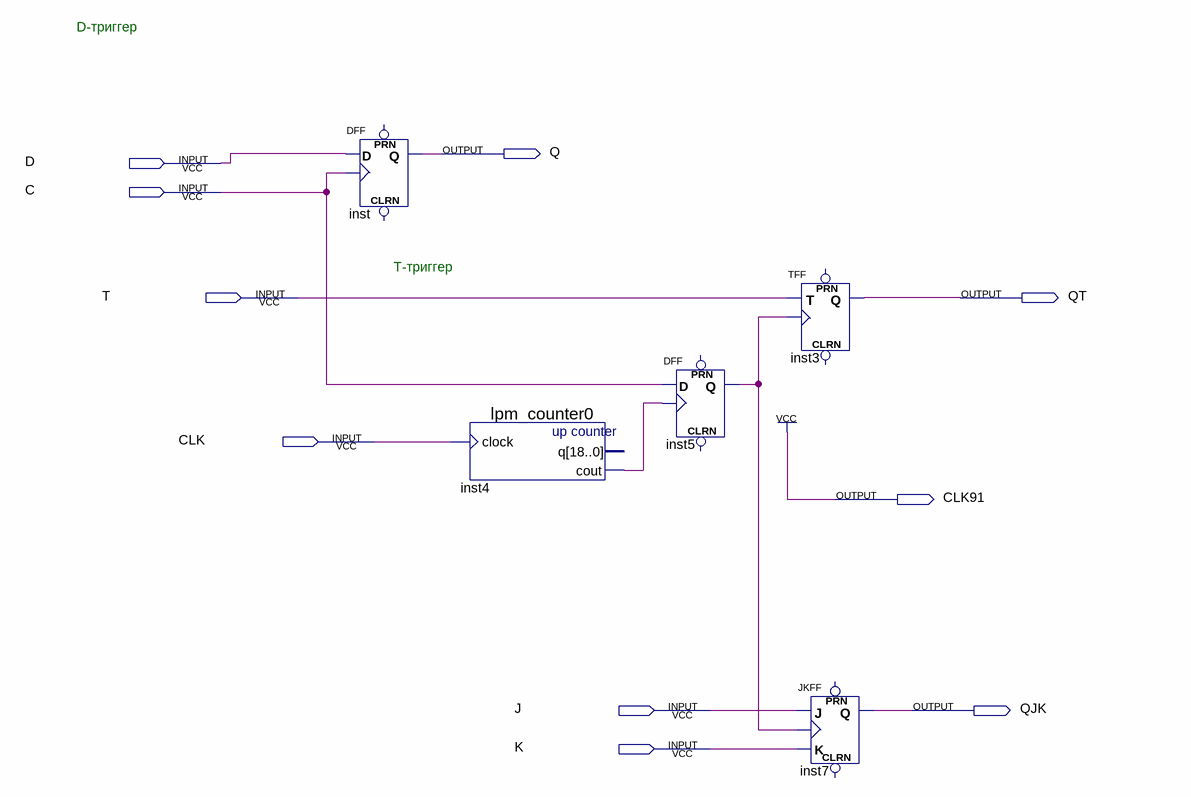
[diagram p0: schematic sheet]
// Quartus schematic D_T_LK-triggers.bdf as structural Verilog: 5 symbols, 10 pins
module \D_T_LK-triggers  (
  input  D,
  input  C,
  input  T,
  input  CLK,
  input  J,
  input  K,
  output Q,
  output QT,
  output CLK91,
  output QJK
);

  wire inst4_cout, inst5_q;

  DFF inst (.CLK(C), .D(D), .Q(Q));  // open: CLRN, PRN
  lpm_counter0 inst4 (.clock(CLK), .cout(inst4_cout));  // open: q
  DFF inst5 (.CLK(inst4_cout), .D(C), .Q(inst5_q));  // open: CLRN, PRN
  TFF inst3 (.T(T), .CLK(inst5_q), .Q(QT));  // open: PRN, CLRN
  JKFF inst7 (.K(K), .J(J), .CLK(inst5_q), .Q(QJK));  // open: PRN, CLRN

  assign CLK91 = 1'b1;

  // Notes on the sheet:
  //   D-триггер
  //   T-триггер
endmodule
